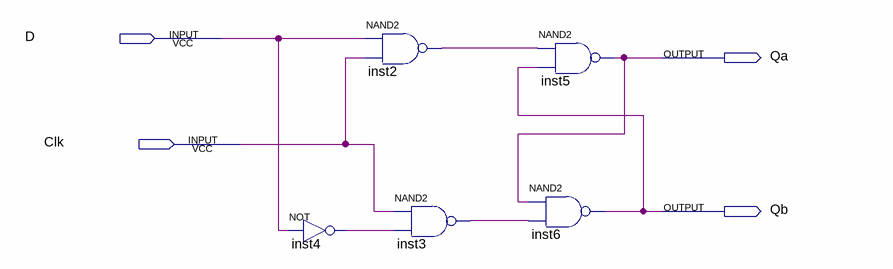
[diagram p0: schematic sheet]
// Quartus schematic aula02_2.bdf as structural Verilog: 5 symbols, 4 pins
module aula02_2 (
  input  D,
  input  Clk,
  output Qa,
  output Qb
);

  wire inst2_out, inst3_out, inst4_out;

  not inst4 (inst4_out, D);
  nand inst2 (inst2_out, D, Clk);
  nand inst3 (inst3_out, Clk, inst4_out);
  nand inst5 (Qa, inst2_out, Qb);
  nand inst6 (Qb, Qa, inst3_out);
endmodule
